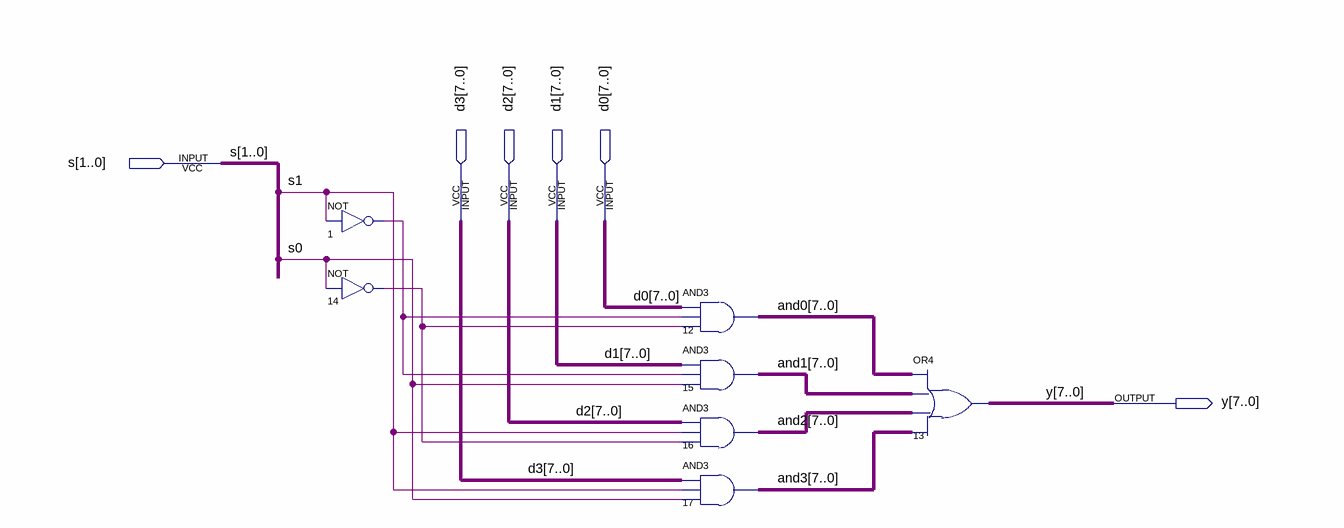
[diagram p0: schematic sheet]
// Quartus schematic 4x8mux.bdf as structural Verilog: 7 symbols, 6 pins
module \4x8mux  (
  input  [1:0] s,
  input  [7:0] d3,
  input  [7:0] d2,
  input  [7:0] d1,
  input  [7:0] d0,
  output [7:0] y
);

  wire n1_out, n14_out;
  wire [7:0] and0, and1, and2, and3;

  not u_1 (n1_out, s[1]);
  not u_14 (n14_out, s[0]);
  assign and0 = d0 & {8{n1_out}} & {8{n14_out}};  // AND3 12, 8 bits wide
  assign and1 = d1 & {8{n1_out}} & {8{s[0]}};  // AND3 15, 8 bits wide
  assign and2 = d2 & {8{s[1]}} & {8{n14_out}};  // AND3 16, 8 bits wide
  assign and3 = d3 & {8{s[1]}} & {8{s[0]}};  // AND3 17, 8 bits wide
  assign y = and0 | and1 | and2 | and3;  // OR4 13, 8 bits wide
endmodule
